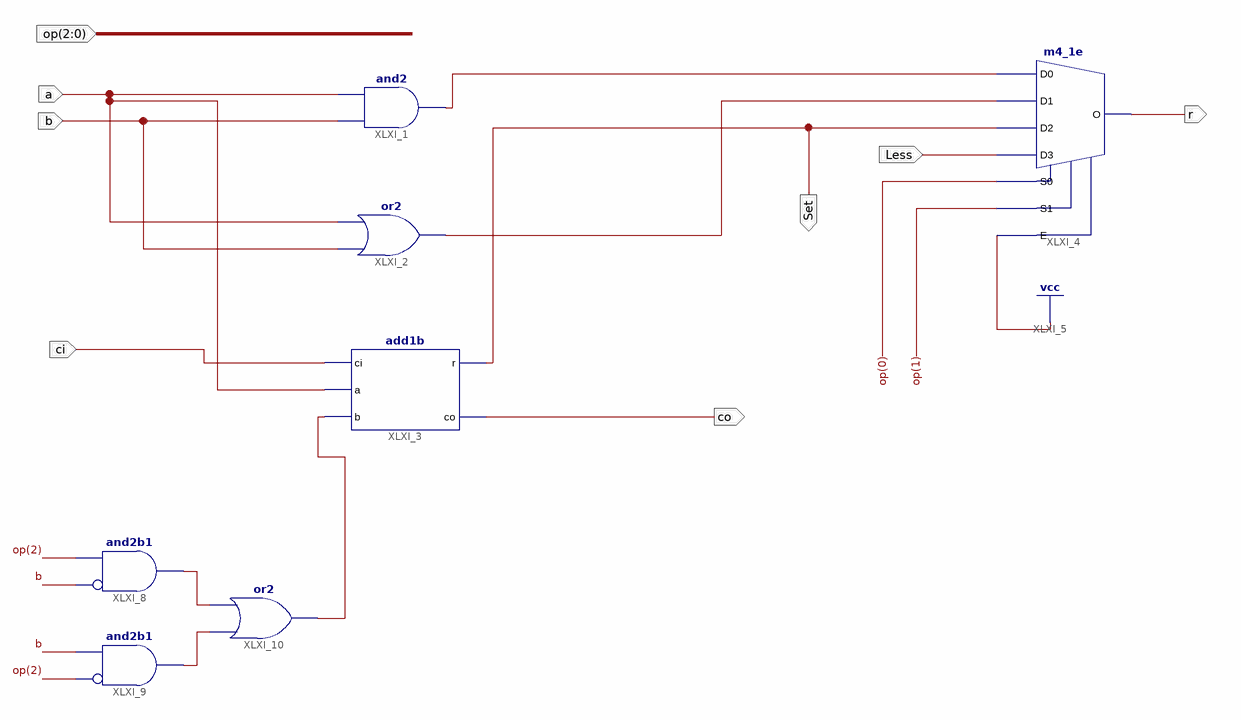
[diagram p0: schematic sheet 1]
// Xilinx ISE schematic alu1b.sch (spartan3e) as structural Verilog: 7 symbols, 8 ports
module alu1b (
  input  a,
  input  [2:0] op,
  input  ci,
  input  b,
  input  Less,
  output co,
  output Set,
  output r
);

  wire XLXN_8, XLXN_17, XLXN_41, XLXN_59, XLXN_60;

  and XLXI_1 (XLXN_8, b, a);
  or XLXI_2 (XLXN_17, b, a);
  add1b XLXI_3 (.ci(ci), .a(a), .b(XLXN_41), .r(Set), .co(co));
  m4_1e XLXI_4 (.D0(XLXN_8), .D1(XLXN_17), .D2(Set), .D3(Less), .E(1'b1), .S0(op[0]), .S1(op[1]), .O(r));
  and XLXI_8 (XLXN_59, ~b, op[2]);  // and2b1
  and XLXI_9 (XLXN_60, ~op[2], b);  // and2b1
  or XLXI_10 (XLXN_41, XLXN_60, XLXN_59);
endmodule
